# Altium project LCD_Controller.PrjPcb
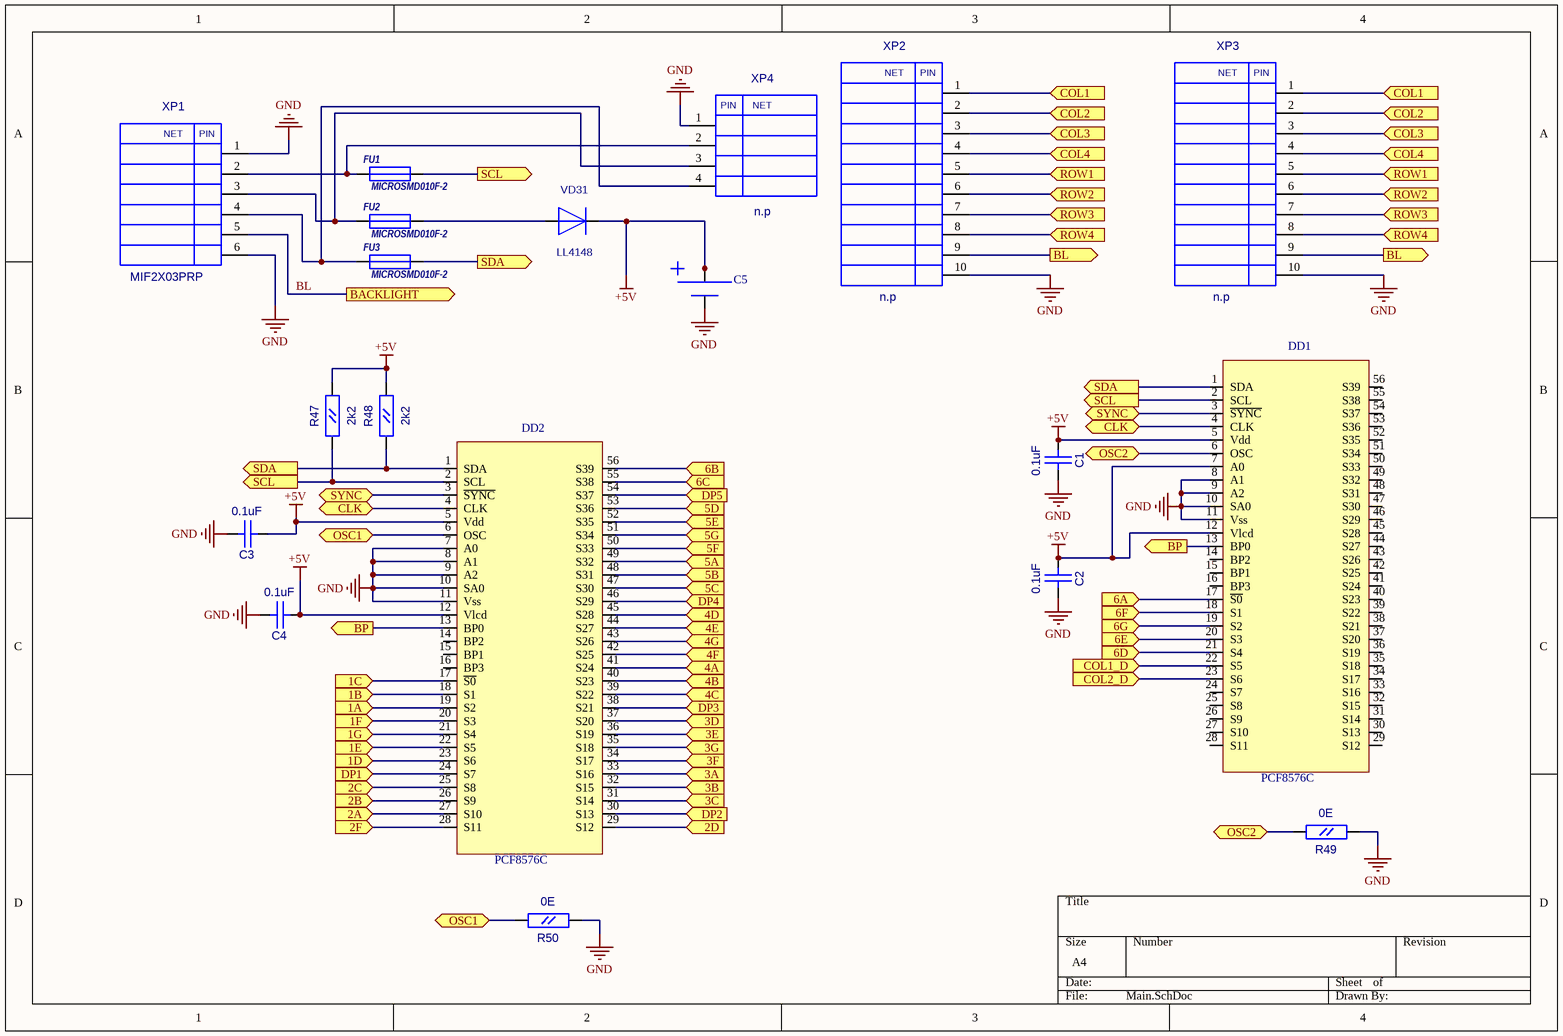
[diagram p0: Main.SchDoc]
3 sheets, 88 parts. Net scope: flat (ports and power ports of the same name join across sheets).
Board file: LCD_Controller.PcbDoc
Sheets:
  Main.SchDoc
  LCD.SchDoc
  LED_backlight.SchDoc

## Sheet Main.SchDoc
size A4

### Parts
C1  0.1uF  [CC0603]
C2  0.1uF  [CC0603]
C3  0.1uF  [CC0603]
C4  0.1uF  [CC0603]
C5  EEC-S5R5H105  [CR2032_ONBOARD]  (value not drawn)
DD1  PCF8576C  [SOT190-1]
DD2  PCF8576C  [SOT190-1]
FU1  MICROSMD010F-2  [RC1210]
FU2  MICROSMD010F-2  [RC1210]
FU3  MICROSMD010F-2  [RC1210]
R47  2k2  [RC0603]
R48  2k2  [RC0603]
R49  0E  [RC0603]
R50  0E  [RC0603]
VD31  LL4148  [SOD-80]
XP1  MIF2X03PRP  [MIF2X03PRP]
XP2  n.p  [BH-10]
XP3  n.p  [BH-10]
XP4  n.p  [MIF2X02PRP]

### Ports
1A (in), 1B (in), 1C (in), 1D (in), 1E (in), 1F (in), 1G (in), 2A (in), 2B (in), 2C (in), 2D (in), 2F (in), 3A (in), 3B (in), 3C (in), 3D (in), 3E (in), 3F (in), 3G (in), 4A (in), 4B (in), 4C (in), 4D (in), 4E (in), 4F (in), 4G (in), 5A (in), 5B (in), 5C (in), 5D (in), 5E (in), 5F (in), 5G (in), 6A (in), 6B (in), 6C (in), 6D (in), 6E (in), 6F (in), 6G (in), BACKLIGHT (out), BL (out), BP (out), CLK, COL1 (in), COL1_D (in), COL2 (in), COL2_D (in), COL3 (in), COL4 (in), DP1 (in), DP2 (in), DP3 (in), DP4 (in), DP5 (in), OSC1, OSC2, ROW1 (in), ROW2 (in), ROW3 (in), ROW4 (in), SCL (out), SDA (out), SYNC

### Nets
+5V: C1.1(A) C2.1(A) C3.1(A) C4.1(A) C5.2 C5.3 C5.4 DD1.5(Vdd) DD1.7(A0) DD1.12(Vlcd) DD2.5(Vdd) DD2.12(Vlcd) R47.2(B) R48.2(B) VD31.2(+)
GND: C1.2(B) C2.2(B) C3.2(B) C4.2(B) C5.1 DD1.8(A1) DD1.9(A2) DD1.10(SA0) DD1.11(Vss) DD2.7(A0) DD2.8(A1) DD2.9(A2) DD2.10(SA0) DD2.11(Vss) R49.1(A) R50.1(A) XP1.1 XP1.6 XP2.10 XP3.10 XP4.1
1A: DD2.19(S2) ; port 1A
1B: DD2.18(S1) ; port 1B
1C: DD2.17(~{S0}) ; port 1C
1D: DD2.23(S6) ; port 1D
1E: DD2.22(S5) ; port 1E
1F: DD2.20(S3) ; port 1F
1G: DD2.21(S4) ; port 1G
2A: DD2.27(S10) ; port 2A
2B: DD2.26(S9) ; port 2B
2C: DD2.25(S8) ; port 2C
2D: DD2.29(S12) ; port 2D
2F: DD2.28(S11) ; port 2F
3A: DD2.33(S16) ; port 3A
3B: DD2.32(S15) ; port 3B
3C: DD2.31(S14) ; port 3C
3D: DD2.37(S20) ; port 3D
3E: DD2.36(S19) ; port 3E
3F: DD2.34(S17) ; port 3F
3G: DD2.35(S18) ; port 3G
4A: DD2.41(S24) ; port 4A
4B: DD2.40(S23) ; port 4B
4C: DD2.39(S22) ; port 4C
4D: DD2.45(S28) ; port 4D
4E: DD2.44(S27) ; port 4E
4F: DD2.42(S25) ; port 4F
4G: DD2.43(S26) ; port 4G
5A: DD2.49(S32) ; port 5A
5B: DD2.48(S31) ; port 5B
5C: DD2.47(S30) ; port 5C
5D: DD2.53(S36) ; port 5D
5E: DD2.52(S35) ; port 5E
5F: DD2.50(S33) ; port 5F
5G: DD2.51(S34) ; port 5G
6A: DD1.17(~{S0}) ; port 6A
6B: DD2.56(S39) ; port 6B
6C: DD2.55(S38) ; port 6C
6D: DD1.21(S4) ; port 6D
6E: DD1.20(S3) ; port 6E
6F: DD1.18(S1) ; port 6F
6G: DD1.19(S2) ; port 6G
BL: XP1.5 ; port BACKLIGHT
BP: DD1.13(BP0) DD2.13(BP0) ; port BP
COL1: DD1.22(S5) ; port COL1_D
COL2: DD1.23(S6) ; port COL2_D
DP: DD2.24(S7) ; port DP1
DP2: DD2.30(S13) ; port DP2
DP3: DD2.38(S21) ; port DP3
DP4: DD2.46(S29) ; port DP4
DP5: DD2.54(S37) ; port DP5
NetDD1_1: DD1.1(SDA) DD2.1(SDA) FU3.2 R48.1(A) ; port SDA
NetDD1_2: DD1.2(SCL) DD2.2(SCL) FU1.2 R47.1(A) ; port SCL
NetDD1_3: DD1.3(~{SYNC}) DD2.3(~{SYNC}) ; port SYNC
NetDD1_4: DD1.4(CLK) DD2.4(CLK) ; port CLK
NetDD1_6: DD1.6(OSC) R49.2(B) ; port OSC2
NetDD2_6: DD2.6(OSC) R50.2(B) ; port OSC1
NetFU1_1: FU1.1 XP1.2 XP4.2
NetFU2_1: FU2.1 XP1.3 XP4.3
NetFU2_2: FU2.2 VD31.1(-)
NetFU3_1: FU3.1 XP1.4 XP4.4
NetXP2_1: XP2.1 XP3.1 ; port COL1
NetXP2_2: XP2.2 XP3.2 ; port COL2
NetXP2_3: XP2.3 XP3.3 ; port COL3
NetXP2_4: XP2.4 XP3.4 ; port COL4
NetXP2_5: XP2.5 XP3.5 ; port ROW1
NetXP2_6: XP2.6 XP3.6 ; port ROW2
NetXP2_7: XP2.7 XP3.7 ; port ROW3
NetXP2_8: XP2.8 XP3.8 ; port ROW4
NetXP2_9: XP2.9 XP3.9 ; port BL

Not connected (* = marked no-connect by the designer): DD1 14(BP2) 15(BP1) 16(BP3) 24(S7) 25(S8) 26(S9) 27(S10) 28(S11) 29(S12) 30(S13) 31(S14) 32(S15) 33(S16) 34(S17) 35(S18) 36(S19) 37(S20) 38(S21) 39(S22) 40(S23) 41(S24) 42(S25) 43(S26) 44(S27) 45(S28) 46(S29) 47(S30) 48(S31) 49(S32) 50(S33) 51(S34) 52(S35) 53(S36) 54(S37) 55(S38) 56(S39); DD2 14(BP2) 15(BP1) 16(BP3)

### Notes on the sheet
- (in symbol BH-10) NET; PIN
- (in symbol MIF2X03PRP) NET; PIN

### Library data of the parts
C1-C4 = CC0603: Value: 0.1uF
C5 = CR2032-VBY2: Value: EEC-S5R5H105
DD1 DD2 = PCF8576: LCD Controller; Value: PCF8576C
FU1-FU3 = MICROSMD: Value: MICROSMD010F-2
R47-R50 = RC0603
  R47 R48: Value: 2k2
  R49 R50: Value: 0E
XP2 XP3 = BH-10: Value: n.p
XP4 = MIF2X02PRP: Value: n.p
VD31 = LL4148: Value: *
XP1 = MIF2X03PRP: Value: *

## Sheet LCD.SchDoc
size A4
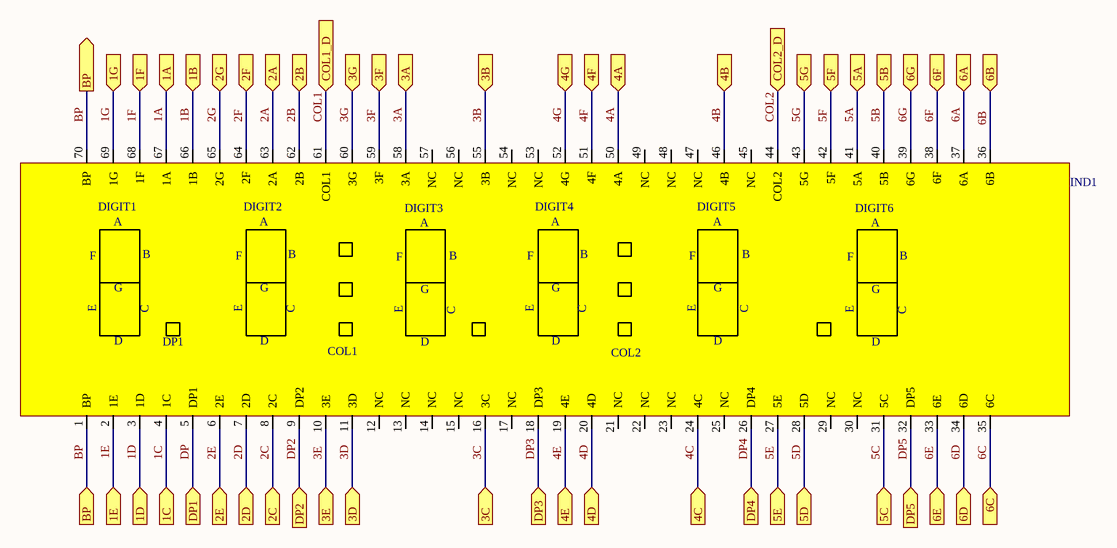
[diagram p1: LCD.SchDoc]

### Parts
IND1  DE156  [IND_DE156]  (value not drawn)

### Ports
1A (in), 1B (in), 1C (in), 1D (in), 1E (in), 1F (in), 1G (in), 2A (in), 2B (in), 2C (in), 2D (in), 2E (in), 2F (in), 2G (in), 3A (in), 3B (in), 3C (in), 3D (in), 3E (in), 3F (in), 3G (in), 4A (in), 4B (in), 4C (in), 4D (in), 4E (in), 4F (in), 4G (in), 5A (in), 5B (in), 5C (in), 5D (in), 5E (in), 5F (in), 5G (in), 6A (in), 6B (in), 6C (in), 6D (in), 6E (in), 6F (in), 6G (in), BP (in), BP (out), COL1_D (in), COL2_D (in), DP1 (in), DP2 (in), DP3 (in), DP4 (in), DP5 (in)

### Nets
1A: IND1.67(1A) ; port 1A
1B: IND1.66(1B) ; port 1B
1C: IND1.4(1C) ; port 1C
1D: IND1.3(1D) ; port 1D
1E: IND1.2(1E) ; port 1E
1F: IND1.68(1F) ; port 1F
1G: IND1.69(1G) ; port 1G
2A: IND1.63(2A) ; port 2A
2B: IND1.62(2B) ; port 2B
2C: IND1.8(2C) ; port 2C
2D: IND1.7(2D) ; port 2D
2E: IND1.6(2E) ; port 2E
2F: IND1.64(2F) ; port 2F
2G: IND1.65(2G) ; port 2G
3A: IND1.58(3A) ; port 3A
3B: IND1.55(3B) ; port 3B
3C: IND1.16(3C) ; port 3C
3D: IND1.11(3D) ; port 3D
3E: IND1.10(3E) ; port 3E
3F: IND1.59(3F) ; port 3F
3G: IND1.60(3G) ; port 3G
4A: IND1.50(4A) ; port 4A
4B: IND1.46(4B) ; port 4B
4C: IND1.24(4C) ; port 4C
4D: IND1.20(4D) ; port 4D
4E: IND1.19(4E) ; port 4E
4F: IND1.51(4F) ; port 4F
4G: IND1.52(4G) ; port 4G
5A: IND1.41(5A) ; port 5A
5B: IND1.40(5B) ; port 5B
5C: IND1.31(5C) ; port 5C
5D: IND1.28(5D) ; port 5D
5E: IND1.27(5E) ; port 5E
5F: IND1.42(5F) ; port 5F
5G: IND1.43(5G) ; port 5G
6A: IND1.37(6A) ; port 6A
6B: IND1.36(6B) ; port 6B
6C: IND1.35(6C) ; port 6C
6D: IND1.34(6D) ; port 6D
6E: IND1.33(6E) ; port 6E
6F: IND1.38(6F) ; port 6F
6G: IND1.39(6G) ; port 6G
BP: IND1.1(BP) IND1.70(BP) ; port BP
COL1: IND1.61(COL1) ; port COL1_D
COL2: IND1.44(COL2) ; port COL2_D
DP: IND1.5(DP1) ; port DP1
DP2: IND1.9(DP2) ; port DP2
DP3: IND1.18(DP3) ; port DP3
DP4: IND1.26(DP4) ; port DP4
DP5: IND1.32(DP5) ; port DP5

Not connected (* = marked no-connect by the designer): IND1 12(NC) 13(NC) 14(NC) 15(NC) 17(NC) 21(NC) 22(NC) 23(NC) 25(NC) 29(NC) 30(NC) 45(NC) 47(NC) 48(NC) 49(NC) 53(NC) 54(NC) 56(NC) 57(NC)

### Notes on the sheet
- (in symbol IND7_DE156) DIGIT1; DIGIT2; DIGIT3; DIGIT4; DIGIT5; DIGIT6; A; F; B; G; E; C; D

### Library data of the parts
IND1 = IND7_DE156: 6digit 7Segment indicator; Value: DE156

## Sheet LED_backlight.SchDoc
size A4
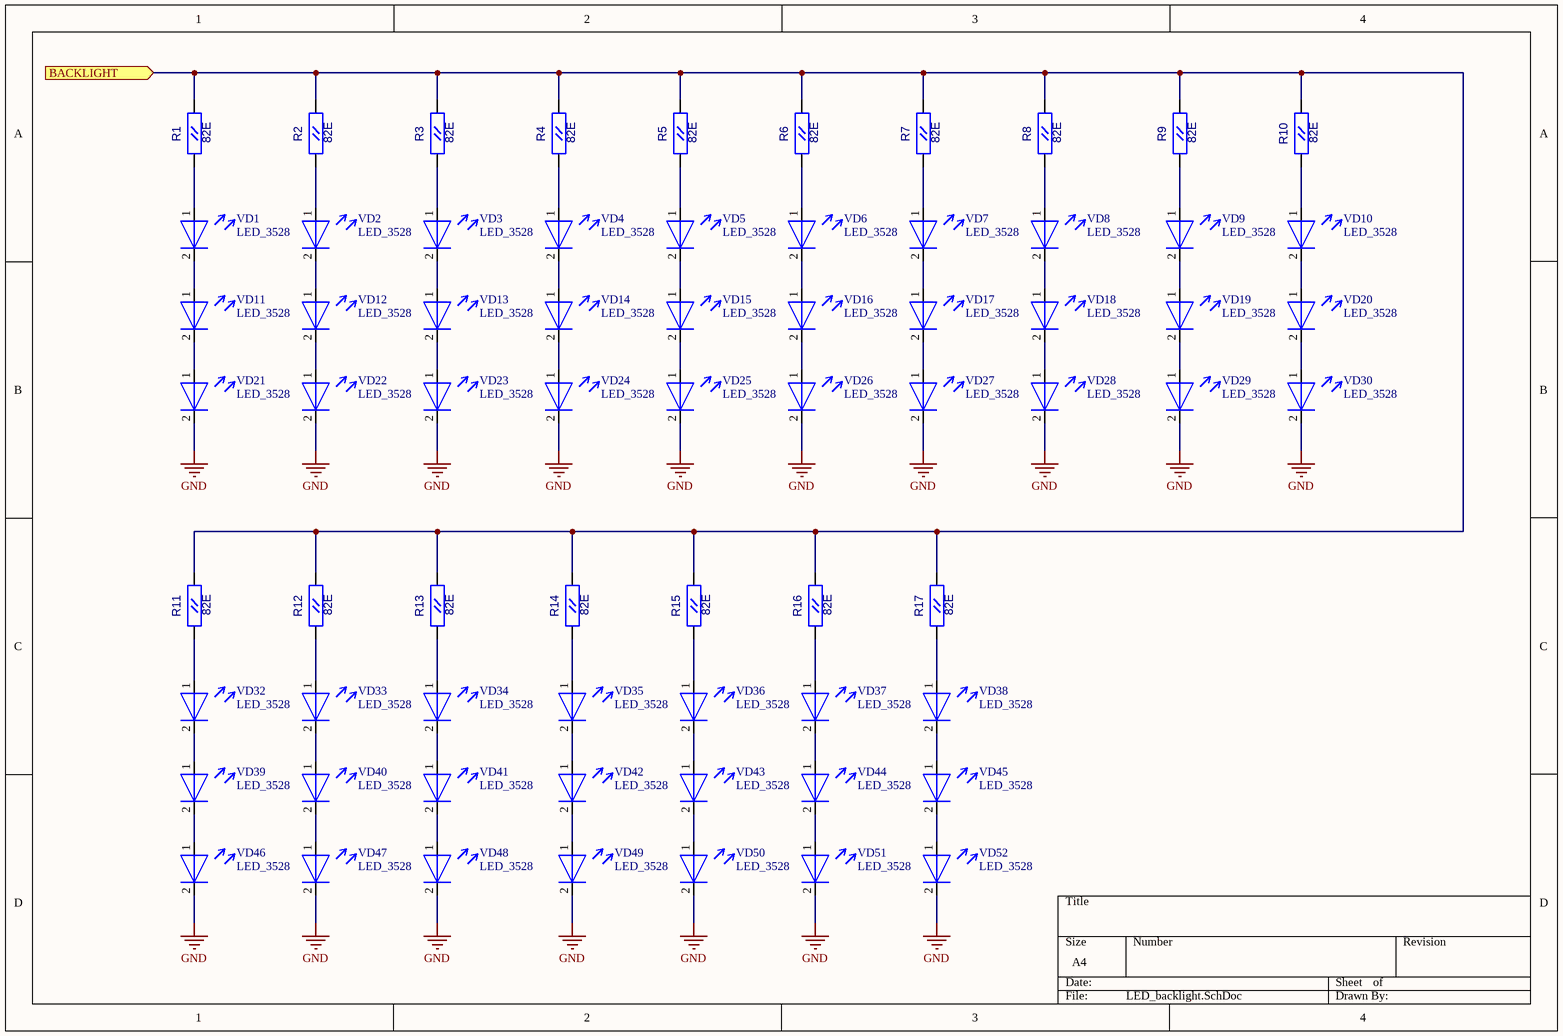
[diagram p2: LED_backlight.SchDoc]

### Parts
R1  82E  [RC0805]
R2  82E  [RC0805]
R3  82E  [RC0805]
R4  82E  [RC0805]
R5  82E  [RC0805]
R6  82E  [RC0805]
R7  82E  [RC0805]
R8  82E  [RC0805]
R9  82E  [RC0805]
R10  82E  [RC0805]
R11  82E  [RC0805]
R12  82E  [RC0805]
R13  82E  [RC0805]
R14  82E  [RC0805]
R15  82E  [RC0805]
R16  82E  [RC0805]
R17  82E  [RC0805]
VD1  LED_3528  [3528LED]
VD2  LED_3528  [3528LED]
VD3  LED_3528  [3528LED]
VD4  LED_3528  [3528LED]
VD5  LED_3528  [3528LED]
VD6  LED_3528  [3528LED]
VD7  LED_3528  [3528LED]
VD8  LED_3528  [3528LED]
VD9  LED_3528  [3528LED]
VD10  LED_3528  [3528LED]
VD11  LED_3528  [3528LED]
VD12  LED_3528  [3528LED]
VD13  LED_3528  [3528LED]
VD14  LED_3528  [3528LED]
VD15  LED_3528  [3528LED]
VD16  LED_3528  [3528LED]
VD17  LED_3528  [3528LED]
VD18  LED_3528  [3528LED]
VD19  LED_3528  [3528LED]
VD20  LED_3528  [3528LED]
VD21  LED_3528  [3528LED]
VD22  LED_3528  [3528LED]
VD23  LED_3528  [3528LED]
VD24  LED_3528  [3528LED]
VD25  LED_3528  [3528LED]
VD26  LED_3528  [3528LED]
VD27  LED_3528  [3528LED]
VD28  LED_3528  [3528LED]
VD29  LED_3528  [3528LED]
VD30  LED_3528  [3528LED]
VD32  LED_3528  [3528LED]
VD33  LED_3528  [3528LED]
VD34  LED_3528  [3528LED]
VD35  LED_3528  [3528LED]
VD36  LED_3528  [3528LED]
VD37  LED_3528  [3528LED]
VD38  LED_3528  [3528LED]
VD39  LED_3528  [3528LED]
VD40  LED_3528  [3528LED]
VD41  LED_3528  [3528LED]
VD42  LED_3528  [3528LED]
VD43  LED_3528  [3528LED]
VD44  LED_3528  [3528LED]
VD45  LED_3528  [3528LED]
VD46  LED_3528  [3528LED]
VD47  LED_3528  [3528LED]
VD48  LED_3528  [3528LED]
VD49  LED_3528  [3528LED]
VD50  LED_3528  [3528LED]
VD51  LED_3528  [3528LED]
VD52  LED_3528  [3528LED]

### Ports
BACKLIGHT (in)

### Nets
GND: VD21.2(K) VD22.2(K) VD23.2(K) VD24.2(K) VD25.2(K) VD26.2(K) VD27.2(K) VD28.2(K) VD29.2(K) VD30.2(K) VD46.2(K) VD47.2(K) VD48.2(K) VD49.2(K) VD50.2(K) VD51.2(K) VD52.2(K)
BL: R1.2(B) R2.2(B) R3.2(B) R4.2(B) R5.2(B) R6.2(B) R7.2(B) R8.2(B) R9.2(B) R10.2(B) R11.2(B) R12.2(B) R13.2(B) R14.2(B) R15.2(B) R16.2(B) R17.2(B) ; port BACKLIGHT
NetR1_1: R1.1(A) VD1.1(A)
NetR2_1: R2.1(A) VD2.1(A)
NetR3_1: R3.1(A) VD3.1(A)
NetR4_1: R4.1(A) VD4.1(A)
NetR5_1: R5.1(A) VD5.1(A)
NetR6_1: R6.1(A) VD6.1(A)
NetR7_1: R7.1(A) VD7.1(A)
NetR8_1: R8.1(A) VD8.1(A)
NetR9_1: R9.1(A) VD9.1(A)
NetR10_1: R10.1(A) VD10.1(A)
NetR11_1: R11.1(A) VD32.1(A)
NetR12_1: R12.1(A) VD33.1(A)
NetR13_1: R13.1(A) VD34.1(A)
NetR14_1: R14.1(A) VD35.1(A)
NetR15_1: R15.1(A) VD36.1(A)
NetR16_1: R16.1(A) VD37.1(A)
NetR17_1: R17.1(A) VD38.1(A)
NetVD1_2: VD1.2(K) VD11.1(A)
NetVD2_2: VD2.2(K) VD12.1(A)
NetVD3_2: VD3.2(K) VD13.1(A)
NetVD4_2: VD4.2(K) VD14.1(A)
NetVD5_2: VD5.2(K) VD15.1(A)
NetVD6_2: VD6.2(K) VD16.1(A)
NetVD7_2: VD7.2(K) VD17.1(A)
NetVD8_2: VD8.2(K) VD18.1(A)
NetVD9_2: VD9.2(K) VD19.1(A)
NetVD10_2: VD10.2(K) VD20.1(A)
NetVD11_2: VD11.2(K) VD21.1(A)
NetVD12_2: VD12.2(K) VD22.1(A)
NetVD13_2: VD13.2(K) VD23.1(A)
NetVD14_2: VD14.2(K) VD24.1(A)
NetVD15_2: VD15.2(K) VD25.1(A)
NetVD16_2: VD16.2(K) VD26.1(A)
NetVD17_2: VD17.2(K) VD27.1(A)
NetVD18_2: VD18.2(K) VD28.1(A)
NetVD19_2: VD19.2(K) VD29.1(A)
NetVD20_2: VD20.2(K) VD30.1(A)
NetVD32_2: VD32.2(K) VD39.1(A)
NetVD33_2: VD33.2(K) VD40.1(A)
NetVD34_2: VD34.2(K) VD41.1(A)
NetVD35_2: VD35.2(K) VD42.1(A)
NetVD36_2: VD36.2(K) VD43.1(A)
NetVD37_2: VD37.2(K) VD44.1(A)
NetVD38_2: VD38.2(K) VD45.1(A)
NetVD39_2: VD39.2(K) VD46.1(A)
NetVD40_2: VD40.2(K) VD47.1(A)
NetVD41_2: VD41.2(K) VD48.1(A)
NetVD42_2: VD42.2(K) VD49.1(A)
NetVD43_2: VD43.2(K) VD50.1(A)
NetVD44_2: VD44.2(K) VD51.1(A)
NetVD45_2: VD45.2(K) VD52.1(A)

### Library data of the parts
R1-R17 = RC0805: Value: 82E
VD1-VD30 VD32-VD52 = 3528LED: Value: LED_3528

## Nets that join several sheets
GND: Main (21 pins), LED_backlight (17 pins)
1A: Main (DD2.19), LCD (IND1.67)
1B: Main (DD2.18), LCD (IND1.66)
1C: Main (DD2.17), LCD (IND1.4)
1D: Main (DD2.23), LCD (IND1.3)
1E: Main (DD2.22), LCD (IND1.2)
1F: Main (DD2.20), LCD (IND1.68)
1G: Main (DD2.21), LCD (IND1.69)
2A: Main (DD2.27), LCD (IND1.63)
2B: Main (DD2.26), LCD (IND1.62)
2C: Main (DD2.25), LCD (IND1.8)
2D: Main (DD2.29), LCD (IND1.7)
2F: Main (DD2.28), LCD (IND1.64)
3A: Main (DD2.33), LCD (IND1.58)
3B: Main (DD2.32), LCD (IND1.55)
3C: Main (DD2.31), LCD (IND1.16)
3D: Main (DD2.37), LCD (IND1.11)
3E: Main (DD2.36), LCD (IND1.10)
3F: Main (DD2.34), LCD (IND1.59)
3G: Main (DD2.35), LCD (IND1.60)
4A: Main (DD2.41), LCD (IND1.50)
4B: Main (DD2.40), LCD (IND1.46)
4C: Main (DD2.39), LCD (IND1.24)
4D: Main (DD2.45), LCD (IND1.20)
4E: Main (DD2.44), LCD (IND1.19)
4F: Main (DD2.42), LCD (IND1.51)
4G: Main (DD2.43), LCD (IND1.52)
5A: Main (DD2.49), LCD (IND1.41)
5B: Main (DD2.48), LCD (IND1.40)
5C: Main (DD2.47), LCD (IND1.31)
5D: Main (DD2.53), LCD (IND1.28)
5E: Main (DD2.52), LCD (IND1.27)
5F: Main (DD2.50), LCD (IND1.42)
5G: Main (DD2.51), LCD (IND1.43)
6A: Main (DD1.17), LCD (IND1.37)
6B: Main (DD2.56), LCD (IND1.36)
6C: Main (DD2.55), LCD (IND1.35)
6D: Main (DD1.21), LCD (IND1.34)
6E: Main (DD1.20), LCD (IND1.33)
6F: Main (DD1.18), LCD (IND1.38)
6G: Main (DD1.19), LCD (IND1.39)
BL: Main (XP1.5), LED_backlight (17 pins)
BP: Main (DD1.13 DD2.13), LCD (IND1.1 IND1.70)
COL1: Main (DD1.22), LCD (IND1.61)
COL2: Main (DD1.23), LCD (IND1.44)
DP: Main (DD2.24), LCD (IND1.5)
DP2: Main (DD2.30), LCD (IND1.9)
DP3: Main (DD2.38), LCD (IND1.18)
DP4: Main (DD2.46), LCD (IND1.26)
DP5: Main (DD2.54), LCD (IND1.32)